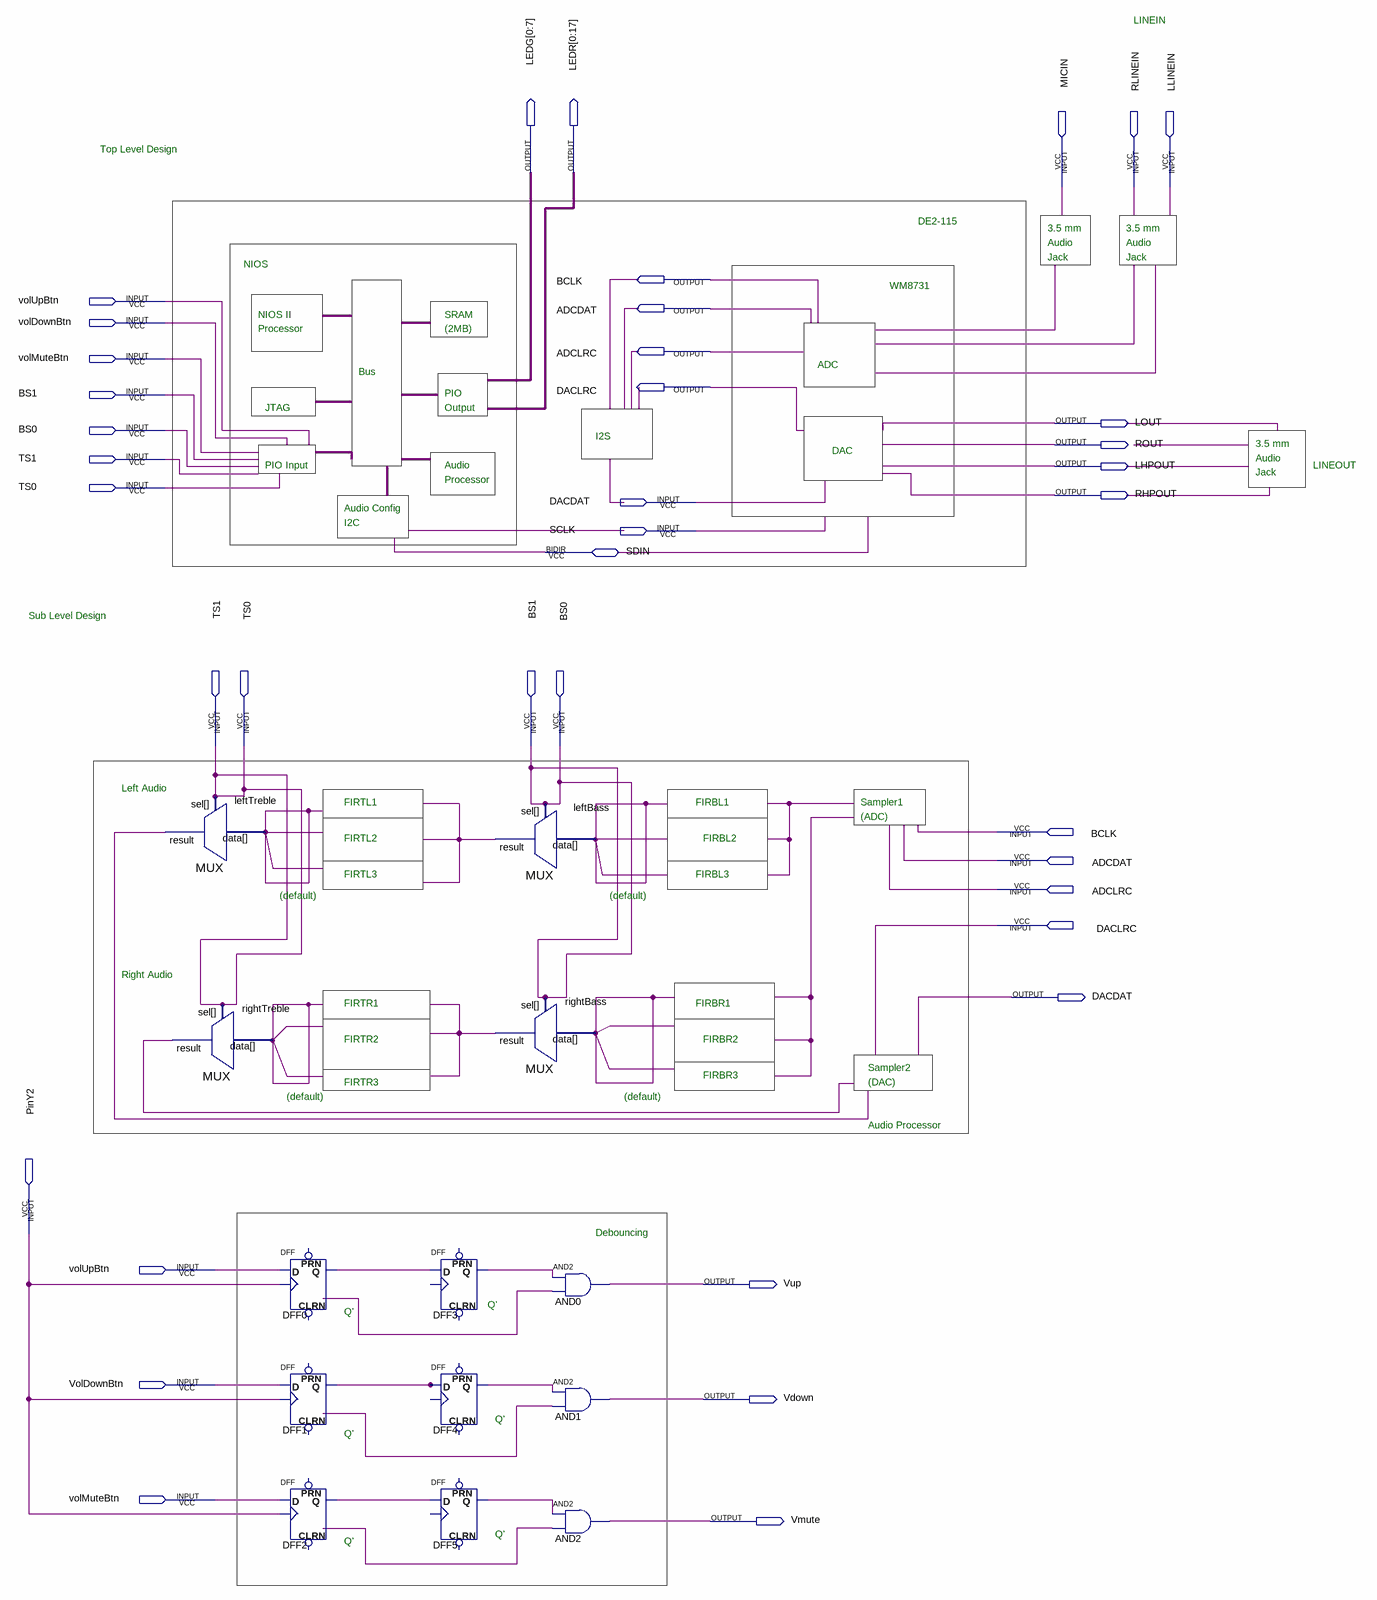
[diagram p0: schematic sheet]
// Quartus schematic audioProcessor.bdf as structural Verilog: 13 symbols, 39 pins
module audioProcessor (
  input  MICIN,
  input  RLINEIN,
  input  LLINEIN,
  input  volUpBtn,
  input  volDownBtn,
  input  volMuteBtn,
  input  BS1,
  input  BS0,
  input  TS1,
  input  TS0,
  inout  DACDAT,
  input  SCLK,
  inout  BCLK,
  inout  ADCDAT,
  inout  ADCLRC,
  inout  DACLRC,
  input  PinY2,
  inout  SDIN,
  output [0:7] LEDG,
  output [0:17] LEDR,
  output LOUT,
  output ROUT,
  output LHPOUT,
  output RHPOUT,
  output Vup,
  output Vdown,
  output Vmute
);

  wire DFF0_q, DFF1_q, DFF2_q, DFF3_q, DFF4_q, DFF5_q, leftBass_result, leftTreble_result, rightBass_result,
       rightTreble_result, undriven, undriven_2, undriven_3, undriven_4, undriven_5, undriven_6, undriven_7;

  MUX leftTreble (.data(undriven_3), .sel(TS0), .result(leftTreble_result));
  MUX rightTreble (.data(undriven_2), .sel(TS0), .result(rightTreble_result));
  DFF DFF0 (.CLK(PinY2), .D(volUpBtn), .Q(DFF0_q));  // open: CLRN, PRN
  DFF DFF1 (.CLK(PinY2), .D(volDownBtn), .Q(DFF1_q));  // open: CLRN, PRN
  DFF DFF2 (.CLK(PinY2), .D(volMuteBtn), .Q(DFF2_q));  // open: CLRN, PRN
  DFF DFF3 (.D(DFF0_q), .Q(DFF3_q));  // open: CLRN, CLK, PRN
  DFF DFF4 (.D(DFF1_q), .Q(DFF4_q));  // open: CLRN, CLK, PRN
  DFF DFF5 (.D(DFF2_q), .Q(DFF5_q));  // open: CLRN, CLK, PRN
  MUX leftBass (.data(undriven_4), .sel(BS0), .result(leftBass_result));
  MUX rightBass (.data(undriven), .sel(BS0), .result(rightBass_result));
  and AND0 (Vup, DFF3_q, undriven_5);
  and AND1 (Vdown, DFF4_q, undriven_6);
  and AND2 (Vmute, DFF5_q, undriven_7);

  assign BS1 = BS0;
  assign TS1 = TS0;

  // Notes on the sheet:
  //   LINEIN
  //   Top Level Design
  //   DE2-115
  //   3.5 mm
  //   3.5 mm
  //   Audio
  //   Audio
  //   Jack
  //   Jack
  //   NIOS
  //   WM8731
  //   NIOS II 
  //   SRAM
  //   Processor
  //   (2MB)
  //   ADC
  //   Bus
  //   PIO 
  //   JTAG
  //   Output
  //   I2S
  //   3.5 mm
  //   DAC
  //   Audio
  //   PIO Input
  //   Audio
  //   LINEOUT
  //   Jack
  //   Processor
  //   Audio Config
  //   I2C
  //   Sub Level Design
  //   Left Audio
  //   FIRTL1
  //   FIRBL1
  //   Sampler1
  //   (ADC)
  //   FIRTL2
  //   FIRBL2
  //   FIRTL3
  //   FIRBL3
  //   (default)
  //   (default)
  //   Right Audio
  //   FIRTR1
  //   FIRBR1
  //   FIRTR2
  //   FIRBR2
  //   Sampler2
  //   FIRBR3
  //   FIRTR3
  //   (DAC)
  //   (default)
  //   (default)
  //   Audio Processor
  //   Debouncing
  //   Q'
  //   Q'
  //   Q'
  //   Q'
  //   Q'
  //   Q'
endmodule
